# Altium schematic sheet Sheet2.SchDoc
size A2
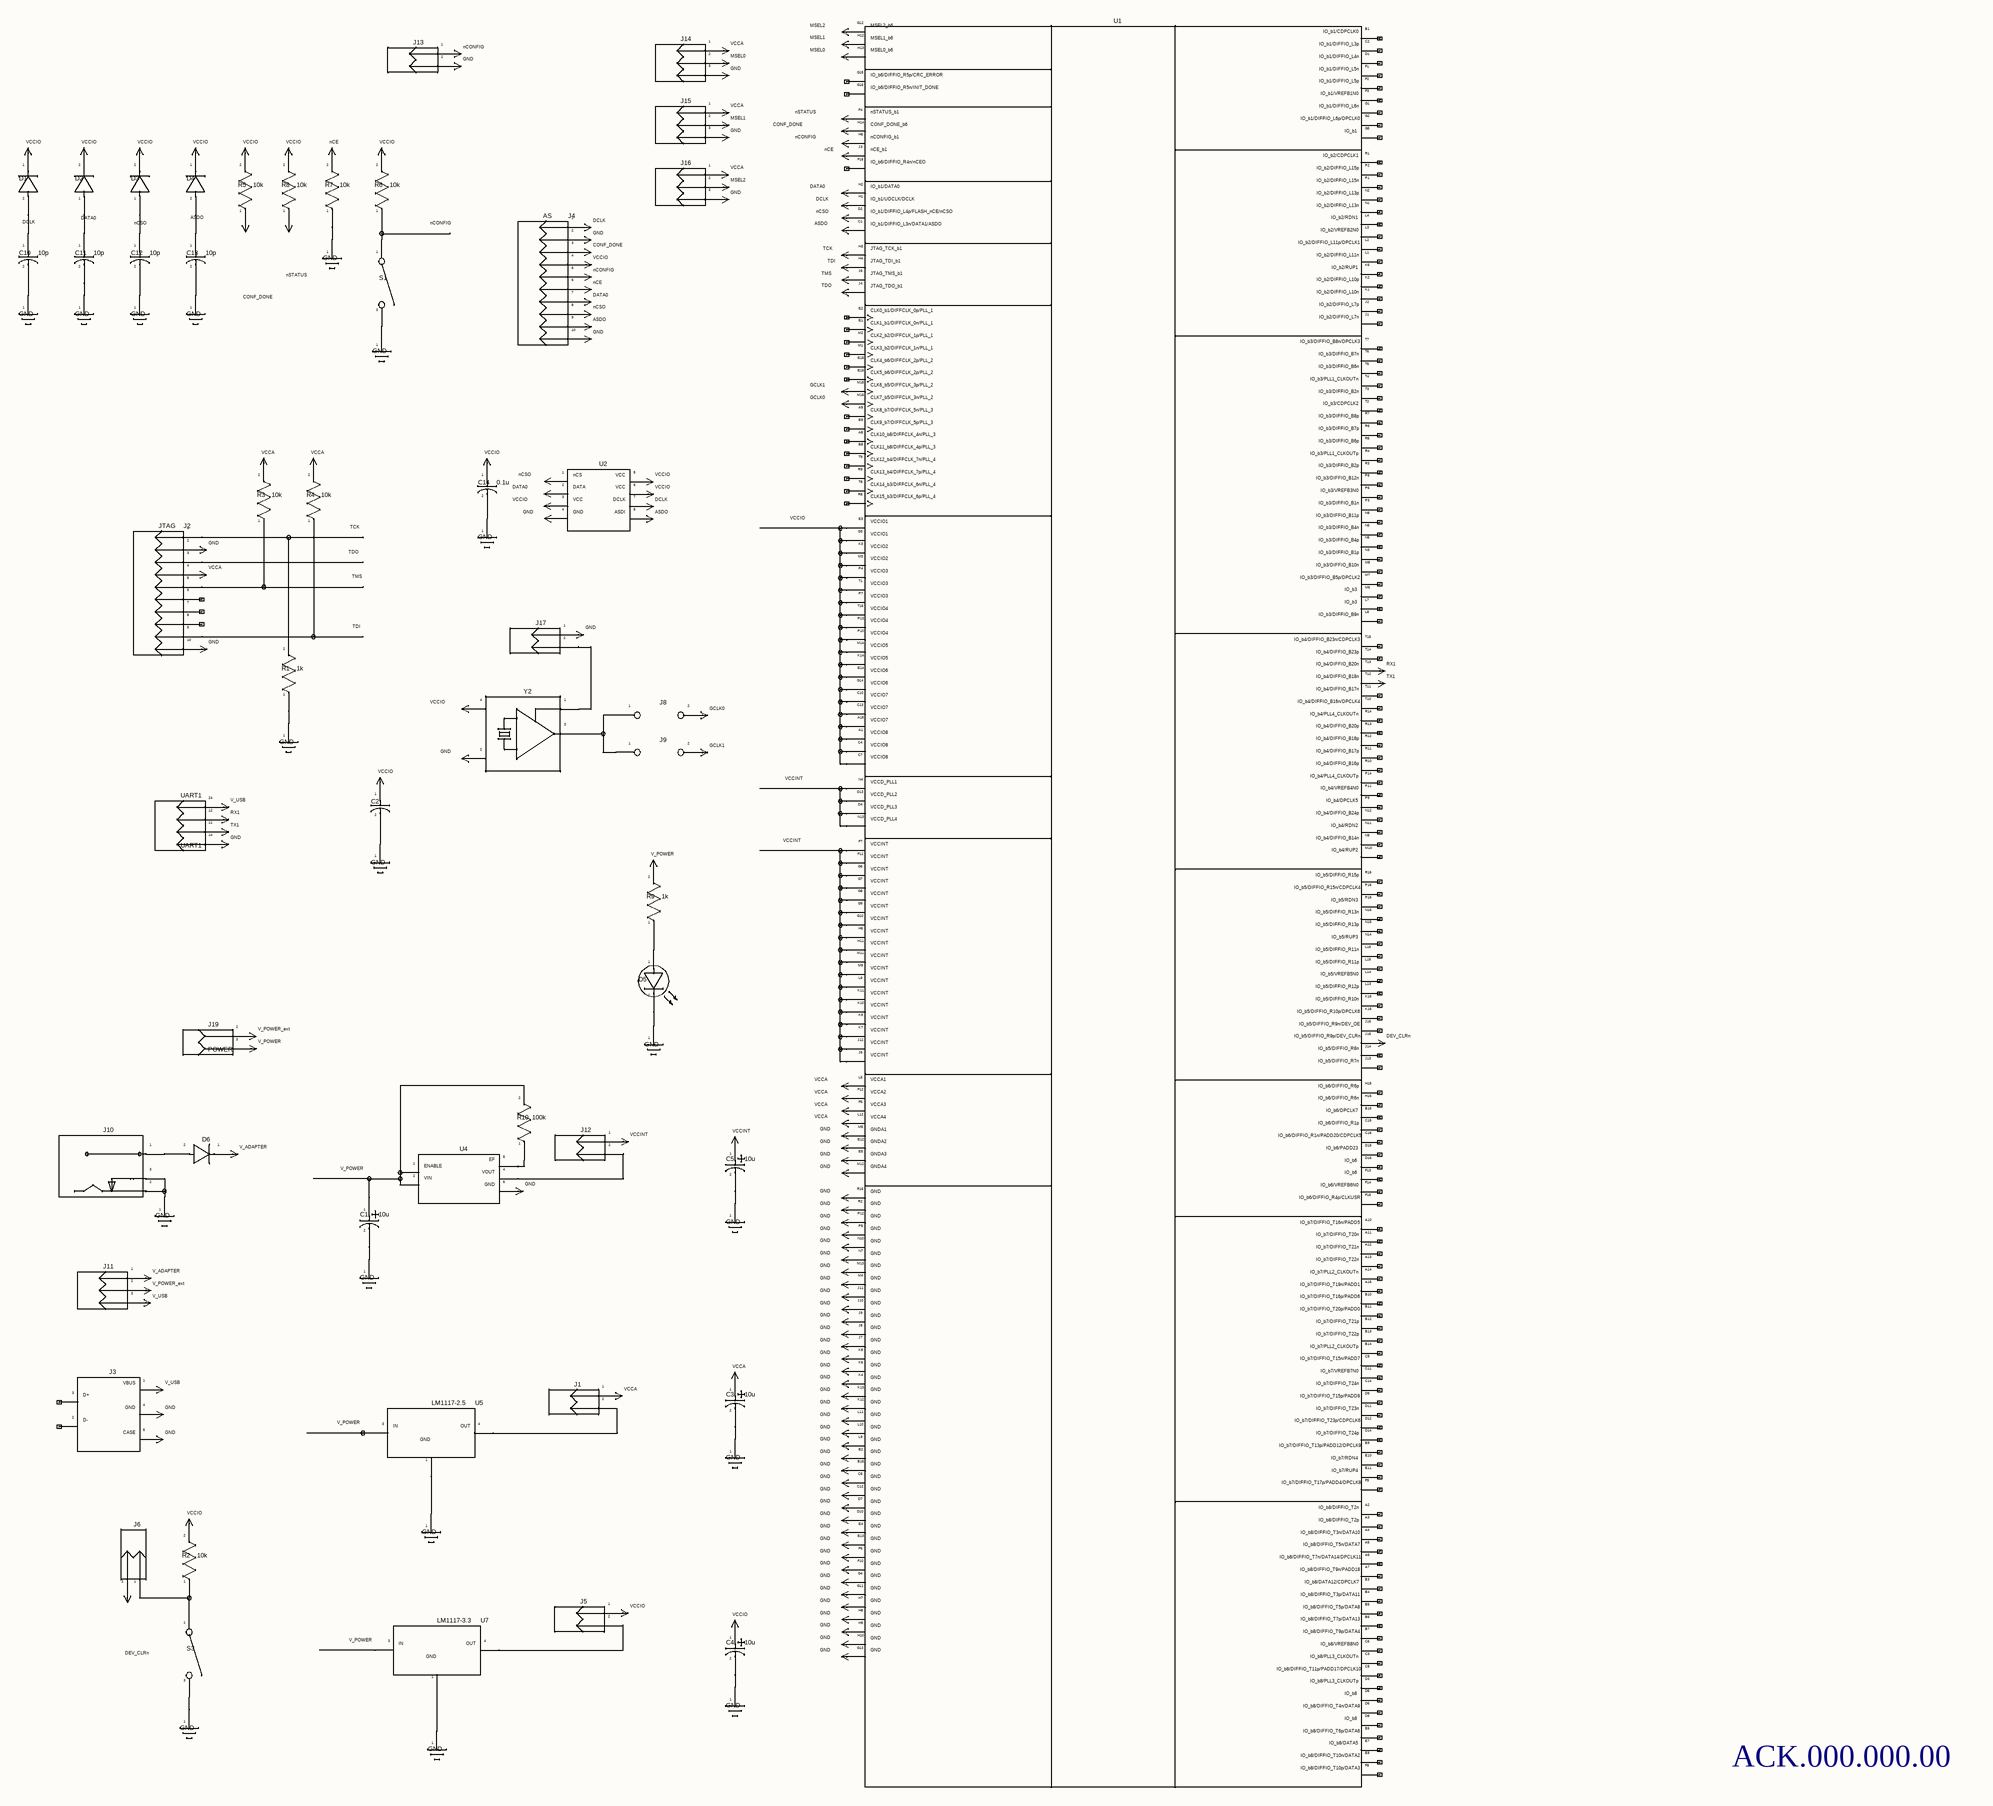
[diagram p0: Sheet2.SchDoc]

## Notes on the sheet
- MSEL2
- MSEL1
- G12
- H12
- MSEL2_b6
- MSEL1_b6
- U1
- IO_b1/CDPCLK0
- B1
- J13
- 1
- 2
- nCONFIG
- GND
- J14
- 3
- VCCA
- MSEL0
- G15
- G16
- H13
- IO_b6/DIFFIO_R5p/CRC_ERROR
- IO_b6/DIFFIO_R5n/INIT_DONE
- MSEL0_b6
- IO_b1/DIFFIO_L3p
- IO_b1/DIFFIO_L4n
- IO_b1/DIFFIO_L5n
- IO_b1/DIFFIO_L5p
- IO_b1/VREFB1N0
- C2
- D1
- F1
- F2
- F3
- VCCIO
- nCE
- J15
- CONF_DONE
- nSTATUS
- H14
- F16
- H5
- F4
- J3
- nSTATUS_b1
- IO_b6/DIFFIO_R4n/nCEO
- nCONFIG_b1
- CONF_DONE_b6
- nCE_b1
- IO_b1/DIFFIO_L6p/DPCLK0
- IO_b1/DIFFIO_L6n
- IO_b2/CDPCLK1
- IO_b1
- G1
- G2
- G5
- R1
- DCLK
- D2
- DATA0
- D3
- nCSO
- D4
- ASDO
- R5
- 10k
- R8
- R7
- R6
- AS
- J4
- J16
- C1
- H1
- H2
- IO_b1/DIFFIO_L3n/DATA1/ASDO
- IO_b1/DIFFIO_L4p/FLASH_nCE/nCSO
- IO_b1/UDCLK/DCLK
- IO_b1/DATA0
- IO_b2/DIFFIO_L13n
- IO_b2/DIFFIO_L13p
- IO_b2/DIFFIO_L15n
- IO_b2/DIFFIO_L15p
- IO_b2/RDN1
- L4
- N1
- N2
- P1
- P2
- C10
- 10p
- C11
- C12
- C13
- S1
- 4
- 5
- 6
- TDO
- TMS
- TCK
- TDI
- H3
- H4
- J5
- JTAG_TCK_b1
- JTAG_TDI_b1
- JTAG_TDO_b1
- JTAG_TMS_b1
- IO_b2/DIFFIO_L11p/DPCLK1
- IO_b2/DIFFIO_L10p
- IO_b2/DIFFIO_L11n
- IO_b2/VREFB2N0
- IO_b2/RUP1
- K2
- K5
- L1
- L2
- L3
- 7
- 8
- 9
- 10
- M1
- M2
- E1
- E2
- CLK1_b1/DIFFCLK_0n/PLL_1
- CLK0_b1/DIFFCLK_0p/PLL_1
- CLK3_b2/DIFFCLK_1n/PLL_1
- CLK2_b2/DIFFCLK_1p/PLL_1
- IO_b3/DIFFIO_B8n/DPCLK3
- IO_b2/DIFFIO_L10n
- IO_b2/DIFFIO_L7n
- IO_b2/DIFFIO_L7p
- J1
- J2
- K1
- T7
- GCLK1
- GCLK0
- M15
- M16
- E15
- E16
- A9
- CLK8_b7/DIFFCLK_5n/PLL_3
- CLK4_b6/DIFFCLK_2p/PLL_2
- CLK5_b6/DIFFCLK_2p/PLL_2
- CLK6_b5/DIFFCLK_3p/PLL_2
- CLK7_b5/DIFFCLK_3n/PLL_2
- IO_b3/PLL1_CLKOUTn
- IO_b3/DIFFIO_B2n
- IO_b3/DIFFIO_B6n
- IO_b3/DIFFIO_B7n
- IO_b3/CDPCLK2
- T2
- T3
- T4
- T5
- T6
- U2
- R9
- A8
- B8
- B9
- T9
- CLK10_b8/DIFFCLK_4n/PLL_3
- CLK11_b8/DIFFCLK_4p/PLL_3
- CLK9_b7/DIFFCLK_5p/PLL_3
- CLK13_b4/DIFFCLK_7p/PLL_4
- CLK12_b4/DIFFCLK_7n/PLL_4
- IO_b3/PLL1_CLKOUTp
- IO_b3/DIFFIO_B2p
- IO_b3/DIFFIO_B6p
- IO_b3/DIFFIO_B7p
- IO_b3/DIFFIO_B8p
- R3
- R4
- JTAG
- C14
- 0.1u
- nCS
- DATA
- VCC
- ASDI
- G3
- E3
- T8
- VCCIO1
- CLK15_b3/DIFFCLK_6p/PLL_4
- CLK14_b3/DIFFCLK_6n/PLL_4
- IO_b3/DIFFIO_B11p
- IO_b3/DIFFIO_B12n
- IO_b3/DIFFIO_B4n
- IO_b3/DIFFIO_B1n
- IO_b3/VREFB3N0
- N6
- N8
- P3
- P6
- P8
- M3
- K3
- P4
- P7
- T1
- VCCIO2
- VCCIO3
- IO_b3/DIFFIO_B5p/DPCLK2
- IO_b3/DIFFIO_B10n
- IO_b3/DIFFIO_B1p
- IO_b3/DIFFIO_B4p
- IO_b3
- M6
- M7
- M8
- N3
- N5
- J17
- M14
- K14
- P10
- P13
- T16
- VCCIO5
- VCCIO4
- IO_b4/DIFFIO_B23n/CDPCLK3
- IO_b4/DIFFIO_B23p
- IO_b3/DIFFIO_B9n
- L7
- L8
- T14
- T15
- 1k
- Y2
- J8
- G14
- A16
- E14
- VCCIO7
- VCCIO6
- IO_b4/DIFFIO_B16n/DPCLK4
- IO_b4/PLL4_CLKOUTn
- IO_b4/DIFFIO_B17n
- IO_b4/DIFFIO_B18n
- IO_b4/DIFFIO_B20n
- R14
- T10
- T11
- T12
- T13
- TX1
- RX1
- J9
- VCCINT
- C4
- C7
- N4
- A1
- VCCIO8
- VCCD_PLL1
- IO_b4/PLL4_CLKOUTp
- IO_b4/DIFFIO_B16p
- IO_b4/DIFFIO_B17p
- IO_b4/DIFFIO_B18p
- IO_b4/DIFFIO_B20p
- P14
- R10
- R11
- R12
- R13
- UART1
- 24
- 12
- 11
- 14
- V_USB
- D13
- N13
- F7
- VCCD_PLL3
- VCCD_PLL2
- VCCD_PLL4
- IO_b4/DIFFIO_B14n
- IO_b4/DIFFIO_B24p
- IO_b4/VREFB4N0
- IO_b4/DPCLK5
- IO_b4/RDN2
- N9
- N11
- N12
- P9
- P11
- V_POWER
- F11
- G6
- G7
- G8
- G9
- IO_b5/DIFFIO_R15n/CDPCLK4
- IO_b5/DIFFIO_R15p
- IO_b5/RDN3
- IO_b4/RUP2
- M10
- P15
- P16
- R16
- M11
- G10
- H11
- M9
- H6
- IO_b5/DIFFIO_R11p
- IO_b5/DIFFIO_R11n
- IO_b5/DIFFIO_R13p
- IO_b5/DIFFIO_R13n
- IO_b5/RUP3
- L15
- L16
- N14
- N15
- N16
- J19
- V_POWER_ext
- D5
- K10
- K11
- K7
- K9
- L6
- IO_b5/DIFFIO_R10p/DPCLK6
- IO_b5/DIFFIO_R9n/DEV_OE
- IO_b5/DIFFIO_R10n
- IO_b5/DIFFIO_R12p
- IO_b5/VREFB5N0
- K15
- K16
- L13
- L14
- POWER
- F12
- J12
- L5
- J6
- VCCA2
- VCCA1
- IO_b5/DIFFIO_R9p/DEV_CLRn
- IO_b6/DIFFIO_R6p
- IO_b5/DIFFIO_R7n
- IO_b5/DIFFIO_R8n
- H15
- DEV_CLRn
- J10
- D6
- V_ADAPTER
- U4
- 100k
- E12
- L12
- M5
- E5
- F5
- GNDA3
- GNDA2
- VCCA3
- VCCA4
- GNDA1
- IO_b6/DIFFIO_R1n/PADD20/CDPCLK5
- IO_b6/DIFFIO_R1p
- IO_b6/DIFFIO_R6n
- IO_b6/DPCLK7
- IO_b6/PADD23
- B16
- C15
- C16
- D15
- H16
- 10u
- ENABLE
- VIN
- VOUT
- EF
- C5
- M12
- R15
- P12
- R2
- GNDA4
- IO_b6/DIFFIO_R4p/CLKUSR
- IO_b6/VREFB6N0
- IO_b6
- D16
- F13
- F14
- F15
- J11
- M13
- N10
- M4
- N7
- P5
- IO_b7/DIFFIO_T16n/PADD5
- IO_b7/PLL2_CLKOUTn
- IO_b7/DIFFIO_T20n
- IO_b7/DIFFIO_T21n
- IO_b7/DIFFIO_T22n
- A10
- A11
- A12
- A13
- A14
- J7
- IO_b7/DIFFIO_T19n/PADD1
- IO_b7/DIFFIO_T16p/PADD6
- IO_b7/DIFFIO_T20p/PADD0
- IO_b7/DIFFIO_T21p
- IO_b7/DIFFIO_T22p
- A15
- B10
- B11
- B12
- B13
- D+
- VBUS
- C3
- K12
- K13
- K4
- K6
- K8
- IO_b7/DIFFIO_T15n/PADD7
- IO_b7/DIFFIO_T15p/PADD8
- IO_b7/PLL2_CLKOUTp
- IO_b7/DIFFIO_T24n
- IO_b7/VREFB7N0
- B14
- C9
- D9
- D-
- CASE
- IN
- LM1117-2.5
- OUT
- U5
- B15
- L10
- L11
- B2
- L9
- IO_b7/DIFFIO_T13p/PADD12/DPCLK9
- IO_b7/DIFFIO_T23p/CDPCLK6
- IO_b7/DIFFIO_T23n
- IO_b7/DIFFIO_T24p
- IO_b7/RDN4
- D11
- D12
- D14
- E9
- E10
- D10
- D7
- E4
- IO_b7/DIFFIO_T17p/PADD4/DPCLK8
- IO_b8/DIFFIO_T2n
- IO_b8/DIFFIO_T2p
- IO_b7/RUP4
- A2
- A3
- E11
- F9
- G11
- E13
- F10
- G4
- F6
- IO_b8/DIFFIO_T7n/DATA14/DPCLK11
- IO_b8/DIFFIO_T9n/PADD18
- IO_b8/DIFFIO_T3n/DATA10
- IO_b8/DIFFIO_T5n/DATA7
- IO_b8/DATA12/CDPCLK7
- A4
- A5
- A6
- A7
- B3
- S3
- LM1117-3.3
- U7
- G13
- H10
- H7
- H8
- H9
- IO_b8/DIFFIO_T3p/DATA11
- IO_b8/DIFFIO_T7p/DATA13
- IO_b8/DIFFIO_T5p/DATA8
- IO_b8/DIFFIO_T9p/DATA4
- IO_b8/VREFB8N0
- B4
- B5
- B6
- B7
- C6
- IO_b8/DIFFIO_T11p/PADD17/DPCLK10
- IO_b8/DIFFIO_T4n/DATA9
- IO_b8/PLL3_CLKOUTn
- IO_b8/PLL3_CLKOUTp
- IO_b8
- C8
- IO_b8/DIFFIO_T10n/DATA2
- IO_b8/DIFFIO_T10p/DATA3
- IO_b8/DIFFIO_T6p/DATA6
- IO_b8/DATA5
- D8
- E6
- E7
- E8
- F8
- ACK.000.000.00